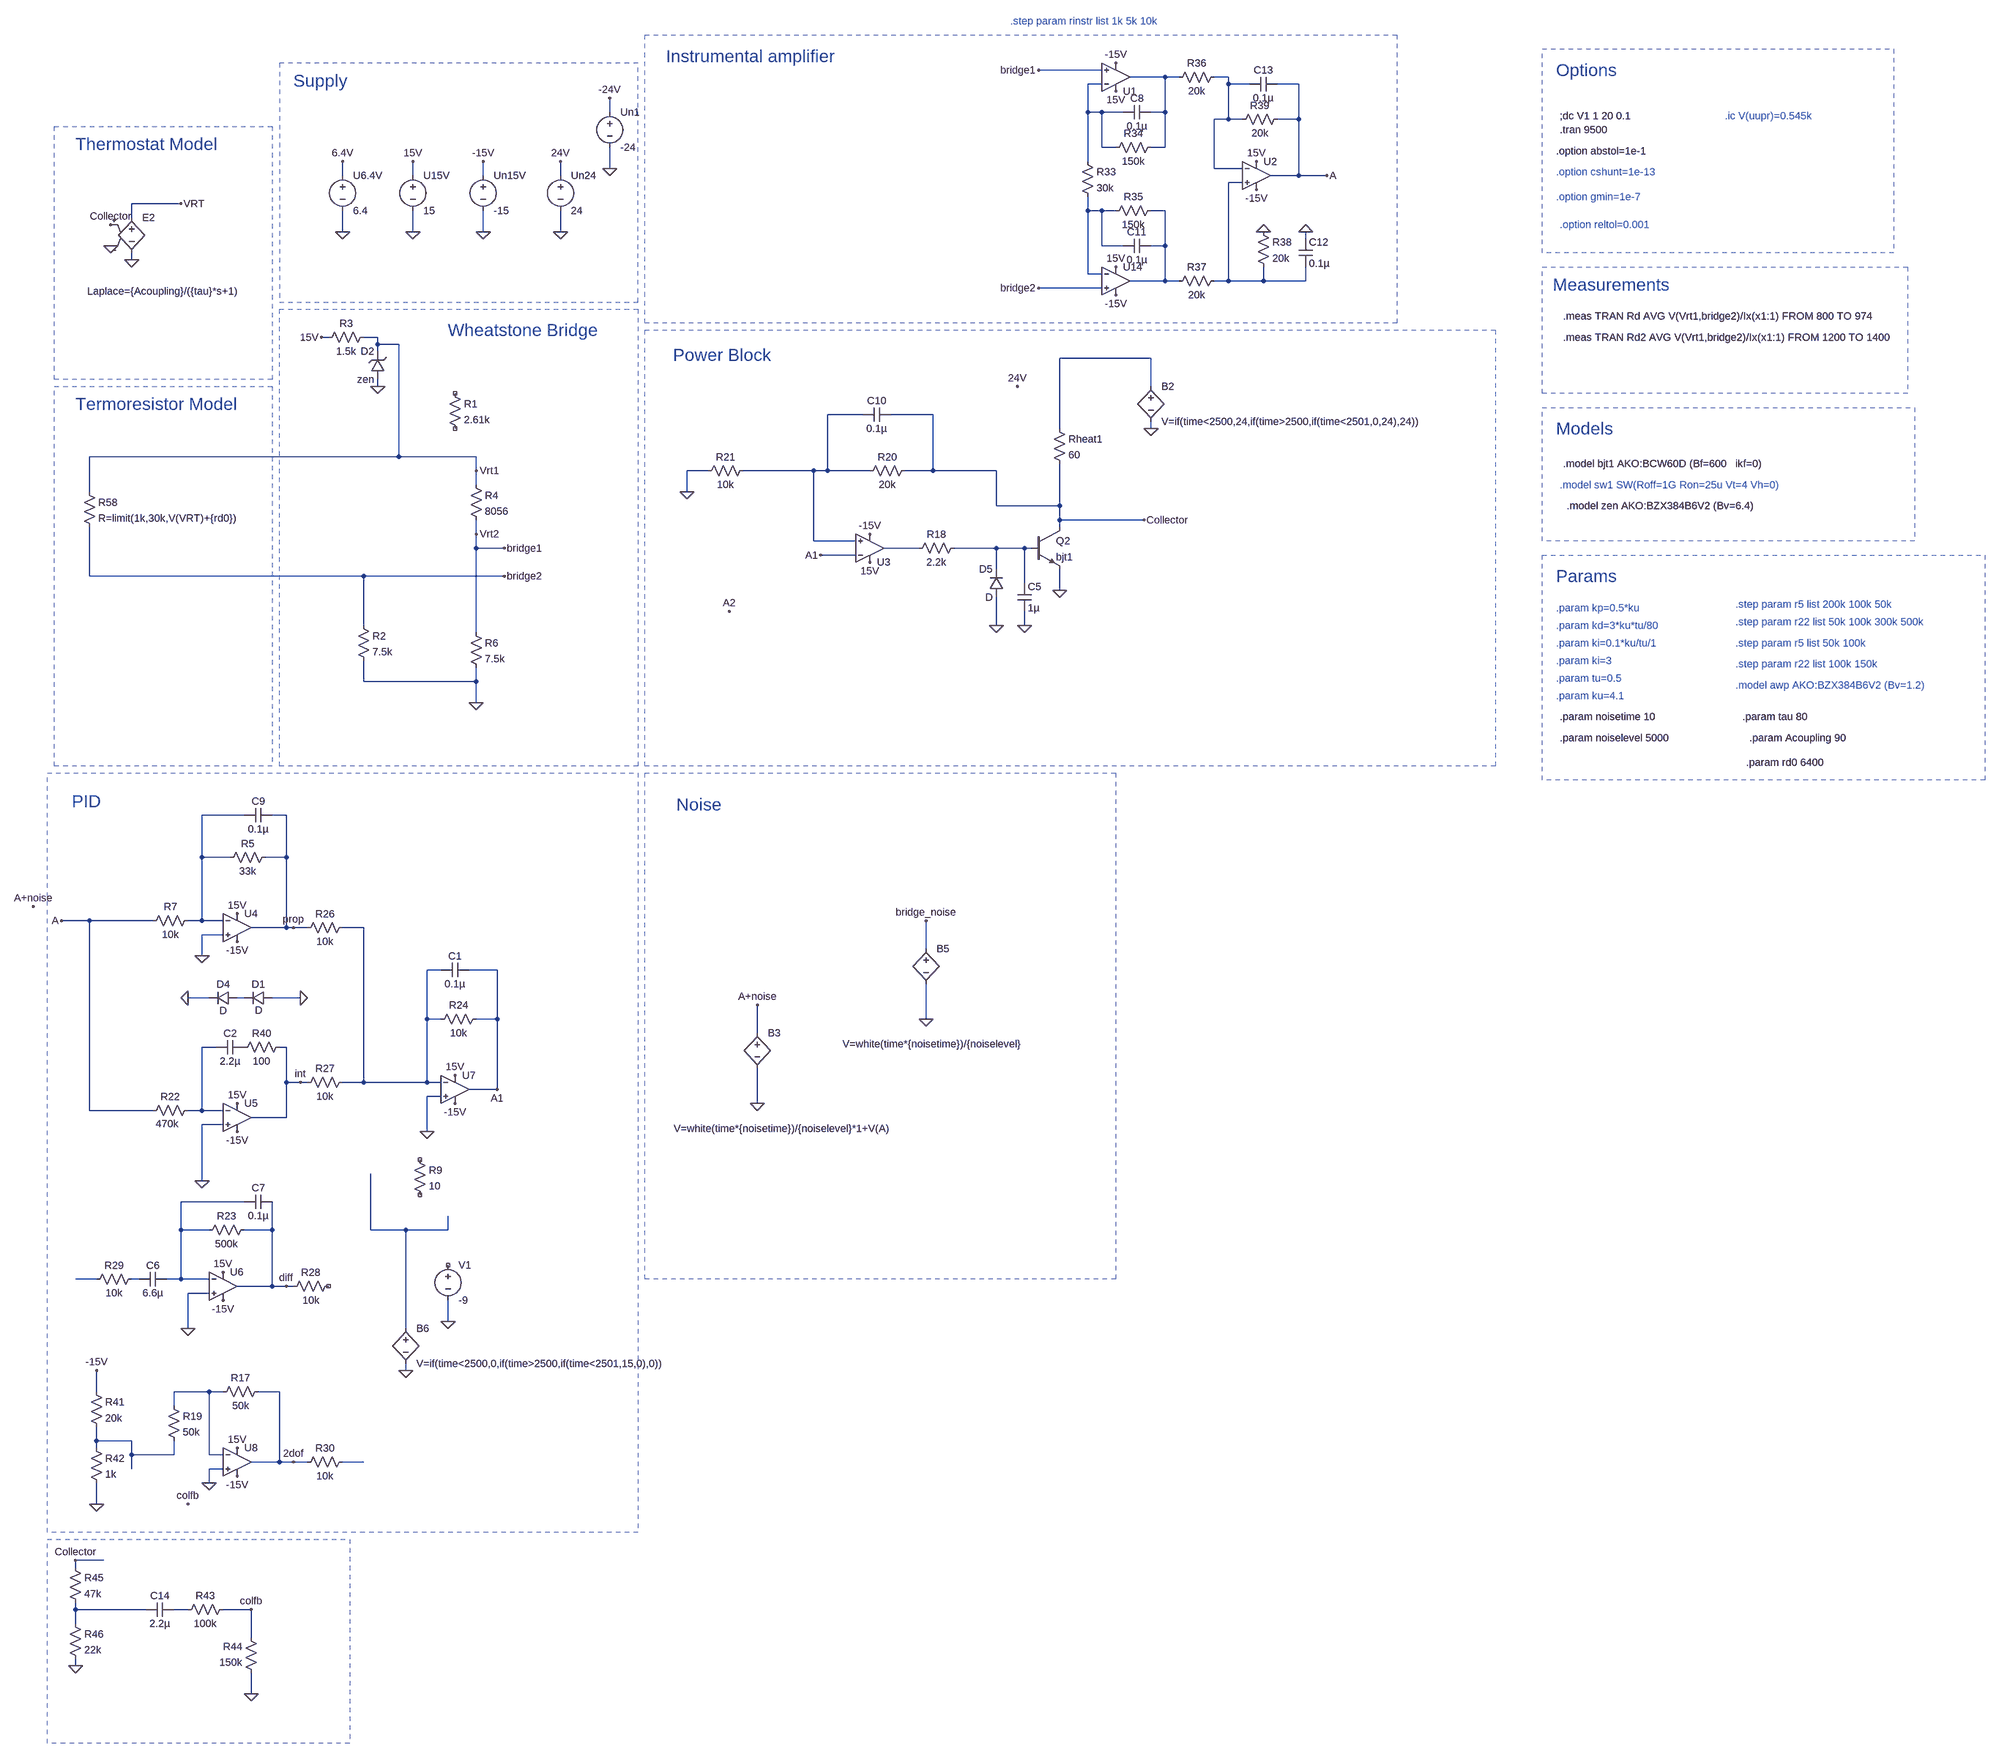
[diagram p0: schematic exp1_model_bez_vozmusheniy.asc]
exp1_model_bez_vozmusheniy.asc, the LTspice schematic file:
Version 4
SHEET 1 2196 8900
WIRE 0 -768 -144 -768
WIRE 144 -752 64 -752
WIRE 176 -752 144 -752
WIRE 288 -752 256 -752
WIRE 0 -736 -32 -736
WIRE 288 -736 288 -752
WIRE 336 -736 288 -736
WIRE 448 -736 400 -736
WIRE -1120 -672 -1120 -704
WIRE -32 -672 -32 -736
WIRE 0 -672 -32 -672
WIRE 48 -672 0 -672
WIRE 144 -672 144 -752
WIRE 144 -672 112 -672
WIRE 288 -656 288 -736
WIRE 288 -656 256 -656
WIRE 320 -656 288 -656
WIRE 448 -656 448 -736
WIRE 448 -656 400 -656
WIRE 0 -592 0 -672
WIRE 32 -592 0 -592
WIRE 144 -592 144 -672
WIRE 144 -592 112 -592
WIRE -32 -560 -32 -672
WIRE -1120 -544 -1120 -592
WIRE 256 -544 256 -656
WIRE 320 -544 256 -544
WIRE -1728 -528 -1728 -560
WIRE -1568 -528 -1568 -560
WIRE -1408 -528 -1408 -560
WIRE -1232 -528 -1232 -560
WIRE 448 -528 448 -656
WIRE 448 -528 384 -528
WIRE 512 -528 448 -528
WIRE 320 -512 288 -512
WIRE -2096 -464 -2208 -464
WIRE -32 -448 -32 -480
WIRE 0 -448 -32 -448
WIRE 32 -448 0 -448
WIRE 144 -448 112 -448
WIRE -2208 -432 -2208 -464
WIRE -1728 -400 -1728 -448
WIRE -1568 -400 -1568 -448
WIRE -1408 -400 -1408 -448
WIRE -1232 -400 -1232 -448
WIRE 464 -384 464 -400
WIRE 0 -368 0 -448
WIRE 48 -368 0 -368
WIRE 144 -368 144 -448
WIRE 144 -368 112 -368
WIRE -2208 -336 -2208 -352
WIRE -32 -304 -32 -448
WIRE 0 -304 -32 -304
WIRE 144 -288 144 -368
WIRE 144 -288 64 -288
WIRE 176 -288 144 -288
WIRE 288 -288 288 -512
WIRE 288 -288 256 -288
WIRE 368 -288 368 -320
WIRE 368 -288 288 -288
WIRE 464 -288 464 -320
WIRE 464 -288 368 -288
WIRE 0 -272 -144 -272
WIRE -1760 -160 -1776 -160
WIRE -1648 -160 -1680 -160
WIRE -1648 -144 -1648 -160
WIRE -1600 -144 -1648 -144
WIRE -1648 -128 -1648 -144
WIRE 112 -112 -96 -112
WIRE -1648 -48 -1648 -64
WIRE 112 -48 112 -112
WIRE -544 16 -624 16
WIRE -384 16 -480 16
WIRE -96 48 -96 -112
WIRE 112 48 112 32
WIRE -1600 112 -1600 -144
WIRE -1600 112 -2304 112
WIRE -1424 112 -1600 112
WIRE -1424 144 -1424 112
WIRE -896 144 -944 144
WIRE -656 144 -816 144
WIRE -624 144 -624 16
WIRE -624 144 -656 144
WIRE -528 144 -624 144
WIRE -384 144 -384 16
WIRE -384 144 -448 144
WIRE -240 144 -384 144
WIRE -1424 176 -1424 144
WIRE -2304 192 -2304 112
WIRE -944 192 -944 144
WIRE -240 224 -240 144
WIRE -96 224 -96 128
WIRE -96 224 -240 224
WIRE -96 256 -96 224
WIRE 96 256 -96 256
WIRE -96 272 -96 256
WIRE -1424 288 -1424 256
WIRE -656 304 -656 144
WIRE -560 304 -656 304
WIRE -1424 320 -1424 288
WIRE -1360 320 -1424 320
WIRE -416 320 -496 320
WIRE -240 320 -336 320
WIRE -176 320 -240 320
WIRE -160 320 -176 320
WIRE -560 336 -640 336
WIRE -240 368 -240 320
WIRE -2304 384 -2304 272
WIRE -1680 384 -2304 384
WIRE -1360 384 -1680 384
WIRE -176 400 -176 320
WIRE -96 416 -96 368
WIRE -1680 496 -1680 384
WIRE -240 496 -240 432
WIRE -176 496 -176 464
WIRE -1424 512 -1424 320
WIRE -1680 624 -1680 576
WIRE -1424 624 -1424 592
WIRE -1424 624 -1680 624
WIRE -1424 672 -1424 624
WIRE -1952 928 -2048 928
WIRE -1856 928 -1888 928
WIRE -2048 1024 -2048 928
WIRE -1984 1024 -2048 1024
WIRE -1856 1024 -1856 928
WIRE -1856 1024 -1904 1024
WIRE -2304 1168 -2368 1168
WIRE -2160 1168 -2304 1168
WIRE -2048 1168 -2048 1024
WIRE -2048 1168 -2080 1168
WIRE -2000 1168 -2048 1168
WIRE -1856 1184 -1856 1024
WIRE -1856 1184 -1936 1184
WIRE -1840 1184 -1856 1184
WIRE -1808 1184 -1840 1184
WIRE -1680 1184 -1728 1184
WIRE -2000 1200 -2048 1200
WIRE -400 1232 -400 1168
WIRE -2048 1248 -2048 1200
WIRE -1504 1280 -1536 1280
WIRE -1376 1280 -1440 1280
WIRE -2032 1344 -2080 1344
WIRE -1952 1344 -1968 1344
WIRE -1824 1344 -1888 1344
WIRE -1536 1392 -1536 1280
WIRE -1504 1392 -1536 1392
WIRE -1376 1392 -1376 1280
WIRE -1376 1392 -1424 1392
WIRE -400 1392 -400 1312
WIRE -784 1424 -784 1360
WIRE -2016 1456 -2048 1456
WIRE -1856 1456 -1872 1456
WIRE -1856 1536 -1856 1456
WIRE -1824 1536 -1856 1536
WIRE -1808 1536 -1824 1536
WIRE -1680 1536 -1680 1184
WIRE -1680 1536 -1728 1536
WIRE -1536 1536 -1536 1392
WIRE -1536 1536 -1680 1536
WIRE -1504 1536 -1536 1536
WIRE -1376 1552 -1376 1392
WIRE -1376 1552 -1440 1552
WIRE -1504 1568 -1536 1568
WIRE -784 1584 -784 1504
WIRE -2304 1600 -2304 1168
WIRE -2160 1600 -2304 1600
WIRE -2048 1600 -2048 1456
WIRE -2048 1600 -2080 1600
WIRE -2000 1600 -2048 1600
WIRE -1856 1616 -1856 1536
WIRE -1856 1616 -1936 1616
WIRE -2000 1632 -2048 1632
WIRE -1536 1648 -1536 1568
WIRE -2048 1760 -2048 1632
WIRE -1952 1808 -2096 1808
WIRE -2096 1872 -2096 1808
WIRE -2032 1872 -2096 1872
WIRE -1888 1872 -1888 1808
WIRE -1888 1872 -1952 1872
WIRE -1664 1872 -1664 1744
WIRE -1584 1872 -1664 1872
WIRE -1488 1872 -1488 1840
WIRE -1488 1872 -1584 1872
WIRE -2288 1984 -2336 1984
WIRE -2192 1984 -2208 1984
WIRE -2096 1984 -2096 1872
WIRE -2096 1984 -2128 1984
WIRE -2032 1984 -2096 1984
WIRE -1888 2000 -1888 1872
WIRE -1888 2000 -1968 2000
WIRE -1856 2000 -1888 2000
WIRE -1840 2000 -1856 2000
WIRE -2032 2016 -2080 2016
WIRE -1488 2080 -1488 2032
WIRE -2080 2096 -2080 2016
WIRE -1584 2096 -1584 1872
WIRE -1584 2192 -1584 2176
WIRE -2288 2240 -2288 2192
WIRE -2032 2240 -2112 2240
WIRE -2000 2240 -2032 2240
WIRE -1872 2240 -1920 2240
WIRE -2112 2272 -2112 2240
WIRE -2288 2352 -2288 2320
WIRE -2208 2352 -2288 2352
WIRE -2288 2368 -2288 2352
WIRE -2208 2384 -2208 2352
WIRE -2112 2384 -2112 2352
WIRE -2112 2384 -2208 2384
WIRE -2032 2384 -2032 2240
WIRE -2000 2384 -2032 2384
WIRE -1872 2400 -1872 2240
WIRE -1872 2400 -1936 2400
WIRE -1840 2400 -1872 2400
WIRE -1808 2400 -1840 2400
WIRE -1680 2400 -1728 2400
WIRE -2208 2416 -2208 2384
WIRE -2000 2416 -2032 2416
WIRE -2032 2448 -2032 2416
WIRE -2288 2496 -2288 2448
WIRE -2272 2624 -2336 2624
WIRE -2336 2640 -2336 2624
WIRE -2336 2736 -2336 2720
WIRE -2176 2736 -2336 2736
WIRE -2080 2736 -2112 2736
WIRE -1936 2736 -2000 2736
WIRE -2336 2768 -2336 2736
WIRE -1936 2800 -1936 2736
WIRE -2336 2864 -2336 2848
WIRE -1936 2928 -1936 2880
FLAG -1728 -400 0
FLAG -1728 -560 6.4V
FLAG -1424 672 0
FLAG -1568 -400 0
FLAG -1568 -560 15V
FLAG -1408 -400 0
FLAG -1408 -560 -15V
FLAG 32 -320 15V
FLAG 32 -256 -15V
FLAG -1232 -400 0
FLAG -1232 -560 24V
FLAG -1360 320 bridge1
FLAG -1360 384 bridge2
FLAG -144 -768 bridge1
FLAG -144 -272 bridge2
FLAG 512 -528 A
FLAG -640 336 A1
FLAG -1424 144 Vrt1
FLAG -1424 288 Vrt2
FLAG -1376 1552 A1
FLAG -2368 1168 A
FLAG -1968 1216 -15V
FLAG -1968 1152 15V
FLAG -1968 1648 -15V
FLAG -1968 1584 15V
FLAG -2000 2032 -15V
FLAG -2000 1968 15V
FLAG -1472 1584 -15V
FLAG -1472 1520 15V
FLAG -2048 1248 0
FLAG -2080 2096 0
FLAG -2256 -368 0
FLAG -2208 -336 0
FLAG -2096 -464 VRT
FLAG -2256 -416 Collector
FLAG -1776 -160 15V
FLAG -1648 -48 0
FLAG -96 416 0
FLAG -192 -48 24V
FLAG -176 496 0
FLAG 96 256 Collector
FLAG -528 288 -15V
FLAG -528 352 15V
FLAG -848 464 A2
FLAG -240 496 0
FLAG -944 192 0
FLAG -1824 1536 int
FLAG -1840 1184 prop
FLAG -1856 2000 diff
FLAG -1968 2432 -15V
FLAG -1968 2368 15V
FLAG -2288 2496 0
FLAG 368 -400 0
FLAG 464 -400 0
FLAG 32 -720 15V
FLAG 32 -784 -15V
FLAG 352 -496 -15V
FLAG 352 -560 15V
FLAG -2288 2192 -15V
FLAG -2336 2624 Collector
FLAG -1936 2928 0
FLAG -2336 2864 0
FLAG -1936 2736 colfb
FLAG -2080 2496 colfb
FLAG -1840 2400 2dof
FLAG -1536 1648 0
FLAG -2032 2448 0
FLAG -1824 1344 0
FLAG -2080 1344 0
FLAG 112 48 0
FLAG -784 1584 0
FLAG -784 1360 A+noise
FLAG -2432 1136 A+noise
FLAG -400 1392 0
FLAG -400 1168 bridge_noise
FLAG -1488 2080 0
FLAG -1584 2192 0
FLAG -2048 1760 0
FLAG -1120 -544 0
FLAG -1120 -704 -24V
DATAFLAG -1600 -144 ""
DATAFLAG 0 256 ""
DATAFLAG -1696 2400 ""
SYMBOL voltage -1728 -544 R0
WINDOW 123 0 0 Left 0
WINDOW 39 0 0 Left 0
SYMATTR InstName U6.4V
SYMATTR Value 6.4
SYMBOL res -1696 480 R0
SYMATTR InstName R2
SYMATTR Value 7.5k
SYMBOL res -1440 160 R0
SYMATTR InstName R4
SYMATTR Value 8056
SYMBOL res -1440 496 R0
SYMATTR InstName R6
SYMATTR Value 7.5k
SYMBOL res -1488 -48 R0
SYMATTR InstName R1
SYMATTR Value 2.61k
SYMBOL voltage -1568 -544 R0
WINDOW 123 0 0 Left 0
WINDOW 39 0 0 Left 0
SYMATTR InstName U15V
SYMATTR Value 15
SYMBOL voltage -1408 -544 R0
WINDOW 123 0 0 Left 0
WINDOW 39 0 0 Left 0
SYMATTR InstName Un15V
SYMATTR Value -15
SYMBOL voltage -1232 -544 R0
WINDOW 123 0 0 Left 0
WINDOW 39 0 0 Left 0
SYMATTR InstName Un24
SYMATTR Value 24
SYMBOL res -1888 1008 R90
WINDOW 0 0 56 VBottom 2
WINDOW 3 32 56 VTop 2
SYMATTR InstName R5
SYMATTR Value 33k
SYMBOL res -2064 1152 R90
WINDOW 0 0 56 VBottom 2
WINDOW 3 32 56 VTop 2
SYMATTR InstName R7
SYMATTR Value 10k
SYMBOL cap -1952 1440 R90
WINDOW 0 0 32 VBottom 2
WINDOW 3 32 32 VTop 2
SYMATTR InstName C2
SYMATTR Value 2.2µ
SYMBOL cap -2128 1968 R90
WINDOW 0 0 32 VBottom 2
WINDOW 3 32 32 VTop 2
SYMATTR InstName C6
SYMATTR Value 6.6µ
SYMBOL res -2064 1584 R90
WINDOW 0 0 56 VBottom 2
WINDOW 3 62 63 VBottom 2
SYMATTR InstName R22
SYMATTR Value 470k
SYMBOL res -1936 1856 R90
WINDOW 0 0 56 VBottom 2
WINDOW 3 32 56 VTop 2
SYMATTR InstName R23
SYMATTR Value 500k
SYMBOL res -1408 1376 R90
WINDOW 0 0 56 VBottom 2
WINDOW 3 32 56 VTop 2
SYMATTR InstName R24
SYMATTR Value 10k
SYMBOL res -1712 1168 R90
WINDOW 0 0 56 VBottom 2
WINDOW 3 32 56 VTop 2
SYMATTR InstName R26
SYMATTR Value 10k
SYMBOL res -1712 1520 R90
WINDOW 0 0 56 VBottom 2
WINDOW 3 32 56 VTop 2
SYMATTR InstName R27
SYMATTR Value 10k
SYMBOL res -1744 1984 R90
WINDOW 0 0 56 VBottom 2
WINDOW 3 32 56 VTop 2
SYMATTR InstName R28
SYMATTR Value 10k
SYMBOL res -2192 1968 R90
WINDOW 0 0 56 VBottom 2
WINDOW 3 32 56 VTop 2
SYMATTR InstName R29
SYMATTR Value 10k
SYMBOL cap -1888 1792 R90
WINDOW 0 0 32 VBottom 2
WINDOW 3 32 32 VTop 2
SYMATTR InstName C7
SYMATTR Value 0.1µ
SYMBOL cap -1888 912 R90
WINDOW 0 0 32 VBottom 2
WINDOW 3 32 32 VTop 2
SYMATTR InstName C9
SYMATTR Value 0.1µ
SYMBOL e -2208 -448 R0
WINDOW 3 -101 183 Left 2
SYMATTR Value Laplace={Acoupling}/({tau}*s+1)
SYMATTR InstName E2
SYMBOL cap -1440 1264 R90
WINDOW 0 0 32 VBottom 2
WINDOW 3 32 32 VTop 2
SYMATTR InstName C1
SYMATTR Value 0.1µ
SYMBOL zener -1632 -64 R180
WINDOW 0 24 64 Left 2
WINDOW 3 24 0 Left 2
SYMATTR InstName D2
SYMATTR Value zen
SYMBOL res -1664 -176 R90
WINDOW 0 0 56 VBottom 2
WINDOW 3 32 56 VTop 2
SYMATTR InstName R3
SYMATTR Value 1.5k
SYMBOL npn -160 272 R0
SYMATTR InstName Q2
SYMATTR Value bjt1
SYMBOL res -112 32 R0
SYMATTR InstName Rheat1
SYMATTR Value 60
SYMBOL res -320 304 R90
WINDOW 0 0 56 VBottom 2
WINDOW 3 32 56 VTop 2
SYMATTR InstName R18
SYMATTR Value 2.2k
SYMBOL cap -192 400 R0
SYMATTR InstName C5
SYMATTR Value 1µ
SYMBOL diode -224 432 R180
WINDOW 0 24 64 Left 2
WINDOW 3 24 0 Left 2
SYMATTR InstName D5
SYMBOL res -432 128 R90
WINDOW 0 0 56 VBottom 2
WINDOW 3 32 56 VTop 2
SYMATTR InstName R20
SYMATTR Value 20k
SYMBOL res -800 128 R90
WINDOW 0 0 56 VBottom 2
WINDOW 3 32 56 VTop 2
SYMATTR InstName R21
SYMATTR Value 10k
SYMBOL cap -480 0 R90
WINDOW 0 0 32 VBottom 2
WINDOW 3 32 32 VTop 2
SYMATTR InstName C10
SYMATTR Value 0.1µ
SYMBOL diode -1968 1328 R90
WINDOW 0 0 32 VBottom 2
WINDOW 3 29 32 VTop 2
SYMATTR InstName D4
SYMBOL res -1904 2224 R90
WINDOW 0 0 56 VBottom 2
WINDOW 3 32 56 VTop 2
SYMATTR InstName R17
SYMATTR Value 50k
SYMBOL res -1712 2384 R90
WINDOW 0 0 56 VBottom 2
WINDOW 3 32 56 VTop 2
SYMATTR InstName R30
SYMATTR Value 10k
SYMBOL res -48 -576 R0
SYMATTR InstName R33
SYMATTR Value 30k
SYMBOL res 128 -608 R90
WINDOW 0 0 56 VBottom 2
WINDOW 3 32 56 VTop 2
SYMATTR InstName R34
SYMATTR Value 150k
SYMBOL res 128 -464 R90
WINDOW 0 0 56 VBottom 2
WINDOW 3 32 56 VTop 2
SYMATTR InstName R35
SYMATTR Value 150k
SYMBOL cap 112 -688 R90
WINDOW 0 0 32 VBottom 2
WINDOW 3 32 32 VTop 2
SYMATTR InstName C8
SYMATTR Value 0.1µ
SYMBOL cap 112 -384 R90
WINDOW 0 0 32 VBottom 2
WINDOW 3 32 32 VTop 2
SYMATTR InstName C11
SYMATTR Value 0.1µ
SYMBOL res 272 -768 R90
WINDOW 0 0 56 VBottom 2
WINDOW 3 32 56 VTop 2
SYMATTR InstName R36
SYMATTR Value 20k
SYMBOL res 272 -304 R90
WINDOW 0 0 56 VBottom 2
WINDOW 3 32 56 VTop 2
SYMATTR InstName R37
SYMATTR Value 20k
SYMBOL res 352 -416 R0
SYMATTR InstName R38
SYMATTR Value 20k
SYMBOL res 416 -672 R90
WINDOW 0 0 56 VBottom 2
WINDOW 3 32 56 VTop 2
SYMATTR InstName R39
SYMATTR Value 20k
SYMBOL cap 448 -384 R0
SYMATTR InstName C12
SYMATTR Value 0.1µ
SYMBOL cap 400 -752 R90
WINDOW 0 0 32 VBottom 2
WINDOW 3 32 32 VTop 2
SYMATTR InstName C13
SYMATTR Value 0.1µ
SYMBOL res -1856 1440 R90
WINDOW 0 0 56 VBottom 2
WINDOW 3 32 56 VTop 2
SYMATTR InstName R40
SYMATTR Value 100
SYMBOL res -2304 2224 R0
SYMATTR InstName R41
SYMATTR Value 20k
SYMBOL res -2304 2352 R0
SYMATTR InstName R42
SYMATTR Value 1k
SYMBOL cap -2112 2720 R90
WINDOW 0 0 32 VBottom 2
WINDOW 3 32 32 VTop 2
SYMATTR InstName C14
SYMATTR Value 2.2µ
SYMBOL res -1984 2720 R90
WINDOW 0 0 56 VBottom 2
WINDOW 3 32 56 VTop 2
SYMATTR InstName R43
SYMATTR Value 100k
SYMBOL res -1920 2896 R180
WINDOW 0 36 76 Left 2
WINDOW 3 36 40 Left 2
SYMATTR InstName R44
SYMATTR Value 150k
SYMBOL res -2352 2624 R0
SYMATTR InstName R45
SYMATTR Value 47k
SYMBOL res -2352 2752 R0
SYMATTR InstName R46
SYMATTR Value 22k
SYMBOL diode -1888 1328 R90
WINDOW 0 0 32 VBottom 2
WINDOW 3 28 31 VTop 2
SYMATTR InstName D1
SYMBOL res -2128 2256 R0
SYMATTR InstName R19
SYMATTR Value 50k
SYMBOL res -2320 176 R0
SYMATTR InstName R58
SYMATTR Value R=limit(1k,30k,V(VRT)+{rd0})
SYMBOL bv 112 -64 R0
SYMATTR InstName B2
SYMATTR Value V=if(time<2500,24,if(time>2500,if(time<2501,0,24),24))
SYMBOL bv -784 1408 R0
WINDOW 3 -190 233 Left 2
SYMATTR Value V=white(time*{noisetime})/{noiselevel}*1+V(A)
SYMATTR InstName B3
SYMBOL bv -400 1216 R0
WINDOW 3 -190 233 Left 2
SYMATTR Value V=white(time*{noisetime})/{noiselevel}
SYMATTR InstName B5
SYMBOL voltage -1488 1936 R0
WINDOW 123 0 0 Left 0
WINDOW 39 0 0 Left 0
SYMATTR InstName V1
SYMATTR Value -9
SYMBOL res -1568 1696 R0
SYMATTR InstName R9
SYMATTR Value 10
SYMBOL bv -1584 2080 R0
SYMATTR InstName B6
SYMATTR Value V=if(time<2500,0,if(time>2500,if(time<2501,15,0),0))
SYMBOL Opamps\\UniversalOpamp2 32 -752 M180
SYMATTR InstName U1
SYMATTR Value2 Avol=250k GBW=10Meg Slew=10Meg
SYMBOL Opamps\\UniversalOpamp2 32 -288 R0
SYMATTR InstName U14
SYMATTR Value2 Avol=250k GBW=10Meg Slew=10Meg
SYMBOL Opamps\\UniversalOpamp2 352 -528 R0
SYMATTR InstName U2
SYMATTR Value2 Avol=250k GBW=10Meg Slew=10Meg
SYMBOL Opamps\\UniversalOpamp2 -528 320 M180
SYMATTR InstName U3
SYMATTR Value2 Avol=250k GBW=10Meg Slew=10Meg
SYMBOL Opamps\\UniversalOpamp2 -1968 1184 R0
SYMATTR InstName U4
SYMATTR Value2 Avol=250k GBW=10Meg Slew=10Meg
SYMBOL Opamps\\UniversalOpamp2 -1968 1616 R0
SYMATTR InstName U5
SYMATTR Value2 Avol=250k GBW=10Meg Slew=10Meg
SYMBOL Opamps\\UniversalOpamp2 -2000 2000 R0
SYMATTR InstName U6
SYMATTR Value2 Avol=250k GBW=10Meg Slew=10Meg
SYMBOL Opamps\\UniversalOpamp2 -1472 1552 R0
SYMATTR InstName U7
SYMATTR Value2 Avol=250k GBW=10Meg Slew=10Meg
SYMBOL Opamps\\UniversalOpamp2 -1968 2400 R0
SYMATTR InstName U8
SYMATTR Value2 Avol=250k GBW=10Meg Slew=10Meg
SYMBOL voltage -1120 -688 R0
WINDOW 123 0 0 Left 0
WINDOW 39 0 0 Left 0
SYMATTR InstName Un1
SYMATTR Value -24
TEXT 1224 -632 Left 2 !.tran 9500
TEXT -1488 -176 Left 4 ;Wheatstone Bridge
TEXT -1840 -744 Left 4 ;Supply
TEXT -2336 -8 Left 4 ;Termoresistor Model
TEXT -2336 -600 Left 4 ;Thermostat Model
TEXT -976 -120 Left 4 ;Power Block
TEXT 1224 176 Left 2 ;.model sw1 SW(Roff=1G Ron=25u Vt=4 Vh=0)
TEXT -2344 896 Left 4 ;PID
TEXT 1216 456 Left 2 ;.param kp=0.5*ku
TEXT 1216 496 Left 2 ;.param kd=3*ku*tu/80
TEXT 1216 536 Left 2 ;.param ki=0.1*ku/tu/1
TEXT 1216 616 Left 2 ;.param tu=0.5
TEXT 1216 656 Left 2 ;.param ku=4.1
TEXT 1216 576 Left 2 ;.param ki=3
TEXT 1600 -664 Left 2 ;.ic V(uupr)=0.545k
TEXT 1232 128 Left 2 !.model bjt1 AKO:BCW60D (Bf=600   ikf=0)
TEXT 1240 224 Left 2 !.model zen AKO:BZX384B6V2 (Bv=6.4)
TEXT 1224 -664 Left 2 !;dc V1 1 20 0.1
TEXT 1216 -584 Left 2 !.option abstol=1e-1
TEXT 1216 -536 Left 2 ;.option cshunt=1e-13
TEXT 1216 -480 Left 2 ;.option gmin=1e-7
TEXT 1224 -416 Left 2 ;.option reltol=0.001
TEXT -208 -880 Left 2 ;.step param rinstr list 1k 5k 10k
TEXT 1624 632 Left 2 ;.model awp AKO:BZX384B6V2 (Bv=1.2)
TEXT 1232 -208 Left 2 !.meas TRAN Rd AVG V(Vrt1,bridge2)/Ix(x1:1) FROM 800 TO 974
TEXT 1232 -160 Left 2 !.meas TRAN Rd2 AVG V(Vrt1,bridge2)/Ix(x1:1) FROM 1200 TO 1400
TEXT 1624 448 Left 2 ;.step param r5 list 200k 100k 50k
TEXT 1624 488 Left 2 ;.step param r22 list 50k 100k 300k 500k
TEXT 1624 584 Left 2 ;.step param r22 list 100k 150k
TEXT 1624 536 Left 2 ;.step param r5 list 50k 100k
TEXT -992 -800 Left 4 ;Instrumental amplifier
TEXT 1208 -280 Left 4 ;Measurements
TEXT 1216 -768 Left 4 ;Options
TEXT 1216 48 Left 4 ;Models
TEXT 1216 384 Left 4 ;Params
TEXT 1224 704 Left 2 !.param noisetime 10
TEXT 1224 752 Left 2 !.param noiselevel 5000
TEXT -968 904 Left 4 ;Noise
TEXT 1640 704 Left 2 !.param tau 80
TEXT 1656 752 Left 2 !.param Acoupling 90
TEXT 1648 808 Left 2 !.param rd0 6400
RECTANGLE Normal -1056 816 -1872 -224 2
RECTANGLE Normal -1056 -784 -1872 -240 2
RECTANGLE Normal 672 -192 -1040 -848 2
RECTANGLE Normal -1888 816 -2384 -48 2
RECTANGLE Normal -1888 -64 -2384 -640 2
RECTANGLE Normal 896 816 -1040 -176 2
RECTANGLE Normal -1056 2560 -2400 832 2
RECTANGLE Normal 32 1984 -1040 832 2
RECTANGLE Normal -1712 3040 -2400 2576 2
RECTANGLE Normal 2016 -32 1184 -320 2
RECTANGLE Normal 1984 -352 1184 -816 2
RECTANGLE Normal 2032 304 1184 0 2
RECTANGLE Normal 2192 848 1184 336 2

The netlist it stands for:
* exp1_model_bez_vozmusheniy.asc
V§U6.4V 6.4V 0 6.4
R2 bridge2 0 7.5k
R4 Vrt1 Vrt2 8056
R6 Vrt2 0 7.5k
R1 NC_01 NC_02 2.61k
V§U15V 15V 0 15
V§Un15V -15V 0 -15
V§Un24 24V 0 24
R5 prop N011 33k
R7 N011 A 10k
C2 P001 N014 2.2µ
C6 N015 N018 6.6µ
R22 N014 A 470k
R23 diff N015 500k
R24 A1 N012 10k
R26 N012 prop 10k
R27 N012 int 10k
R28 NC_03 diff 10k
R29 N018 N017 10k
C7 diff N015 0.1µ
C9 prop N011 0.1µ
E2 VRT 0 Collector 0 Laplace={Acoupling}/({tau}*s+1)
C1 A1 N012 0.1µ
D2 0 Vrt1 zen
R3 Vrt1 15V 1.5k
Q2 Collector N010 0 0 bjt1
Rheat1 N007 Collector 60
R18 N010 N009 2.2k
C5 N010 0 1µ
D5 0 N010 D
R20 Collector N008 20k
R21 N008 0 10k
C10 Collector N008 0.1µ
D4 N013 0 D
R17 2dof N019 50k
R30 N021 2dof 10k
R33 N003 N005 30k
R34 N001 N003 150k
R35 N006 N005 150k
C8 N001 N003 0.1µ
C11 N006 N005 0.1µ
R36 N002 N001 20k
R37 N004 N006 20k
R38 0 N004 20k
R39 A N002 20k
C12 0 N004 0.1µ
C13 A N002 0.1µ
R40 int P001 100
R41 -15V N020 20k
R42 N020 0 1k
C14 N023 N022 2.2µ
R43 colfb N023 100k
R44 0 colfb 150k
R45 Collector N022 47k
R46 N022 0 22k
D1 0 N013 D
R19 N019 N020 50k
R58 Vrt1 bridge2 R=limit(1k,30k,V(VRT)+{rd0})
B2 N007 0 V=if(time<2500,24,if(time>2500,if(time<2501,0,24),24))
B3 A+noise 0 V=white(time*{noisetime})/{noiselevel}*1+V(A)
B5 bridge_noise 0 V=white(time*{noisetime})/{noiselevel}
V1 NC_04 0 -9
R9 NC_05 NC_06 10
B6 N016 0 V=if(time<2500,0,if(time>2500,if(time<2501,15,0),0))
XU1 Vrt2 N003 15V -15V N001 level.2 Avol=250k GBW=10Meg Slew=10Meg ilimit=25m rail=0 Vos=0 phimargin=45 en=0 enk=0 in=0 ink=0 Rin=500Meg  ; pins IN+ IN- V+ V- OUT
XU14 bridge2 N005 15V -15V N006 level.2 Avol=250k GBW=10Meg Slew=10Meg ilimit=25m rail=0 Vos=0 phimargin=45 en=0 enk=0 in=0 ink=0 Rin=500Meg  ; pins IN+ IN- V+ V- OUT
XU2 N004 N002 15V -15V A level.2 Avol=250k GBW=10Meg Slew=10Meg ilimit=25m rail=0 Vos=0 phimargin=45 en=0 enk=0 in=0 ink=0 Rin=500Meg  ; pins IN+ IN- V+ V- OUT
XU3 N008 A1 15V -15V N009 level.2 Avol=250k GBW=10Meg Slew=10Meg ilimit=25m rail=0 Vos=0 phimargin=45 en=0 enk=0 in=0 ink=0 Rin=500Meg  ; pins IN+ IN- V+ V- OUT
XU4 0 N011 15V -15V prop level.2 Avol=250k GBW=10Meg Slew=10Meg ilimit=25m rail=0 Vos=0 phimargin=45 en=0 enk=0 in=0 ink=0 Rin=500Meg  ; pins IN+ IN- V+ V- OUT
XU5 0 N014 15V -15V int level.2 Avol=250k GBW=10Meg Slew=10Meg ilimit=25m rail=0 Vos=0 phimargin=45 en=0 enk=0 in=0 ink=0 Rin=500Meg  ; pins IN+ IN- V+ V- OUT
XU6 0 N015 15V -15V diff level.2 Avol=250k GBW=10Meg Slew=10Meg ilimit=25m rail=0 Vos=0 phimargin=45 en=0 enk=0 in=0 ink=0 Rin=500Meg  ; pins IN+ IN- V+ V- OUT
XU7 0 N012 15V -15V A1 level.2 Avol=250k GBW=10Meg Slew=10Meg ilimit=25m rail=0 Vos=0 phimargin=45 en=0 enk=0 in=0 ink=0 Rin=500Meg  ; pins IN+ IN- V+ V- OUT
XU8 0 N019 15V -15V 2dof level.2 Avol=250k GBW=10Meg Slew=10Meg ilimit=25m rail=0 Vos=0 phimargin=45 en=0 enk=0 in=0 ink=0 Rin=500Meg  ; pins IN+ IN- V+ V- OUT
V§Un1 -24V 0 -24
.model D D
.lib standard.dio
.model NPN NPN
.model PNP PNP
.lib standard.bjt
.tran 9500
* Wheatstone Bridge
* Supply
* Termoresistor Model
* Thermostat Model
* Power Block
* .model sw1 SW(Roff=1G Ron=25u Vt=4 Vh=0)
* PID
* .param kp=0.5*ku
* .param kd=3*ku*tu/80
* .param ki=0.1*ku/tu/1
* .param tu=0.5
* .param ku=4.1
* .param ki=3
* .ic V(uupr)=0.545k
.model bjt1 AKO:BCW60D (Bf=600   ikf=0)
.model zen AKO:BZX384B6V2 (Bv=6.4)
;dc V1 1 20 0.1
.option abstol=1e-1
* .option cshunt=1e-13
* .option gmin=1e-7
* .option reltol=0.001
* .step param rinstr list 1k 5k 10k
* .model awp AKO:BZX384B6V2 (Bv=1.2)
.meas TRAN Rd AVG V(Vrt1,bridge2)/Ix(x1:1) FROM 800 TO 974
.meas TRAN Rd2 AVG V(Vrt1,bridge2)/Ix(x1:1) FROM 1200 TO 1400
* .step param r5 list 200k 100k 50k
* .step param r22 list 50k 100k 300k 500k
* .step param r22 list 100k 150k
* .step param r5 list 50k 100k
* Instrumental amplifier
* Measurements
* Options
* Models
* Params
.param noisetime 10
.param noiselevel 5000
* Noise
.param tau 80
.param Acoupling 90
.param rd0 6400
.lib UniversalOpamps2.sub
.backanno
.end